# Altium schematic sheet Part19_UART_CP2104.SchDoc
size A4
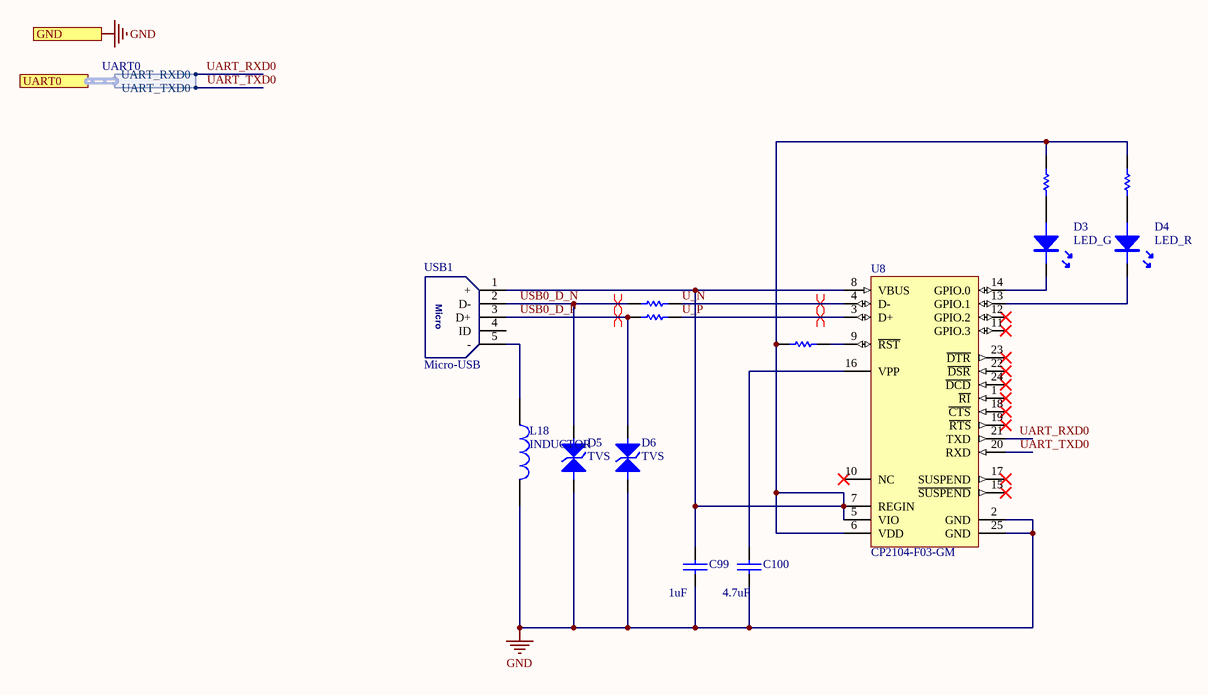
[diagram p0: Part19_UART_CP2104.SchDoc]

## Parts
C99  1uF  [0603C]
C100  4.7uF  [0603C]
D3  LED_G  [LED-0603B]
D4  LED_R  [LED-0603B]
D5  TVS  [SOD-123]
D6  TVS  [SOD-123]
L18  INDUCTOR  [0603L]
R77  470R  [0402R]  (value not drawn)
R78  470R  [0402R]  (value not drawn)
R79  22R  [0402R]  (value not drawn)
R80  22R  [0402R]  (value not drawn)
R81  4.7k  [0402R]  (value not drawn)
U8  CP2104-F03-GM  [SLAB-QFN-24-2675x2675TP_M]
USB1  Micro-USB  [USB-micro_B]

## Ports
GND, UART0 (harness UART0)

## Harnesses
UART0: UART_RXD0, UART_TXD0

## Nets
GND: C99.1 C100.1 D5.K D6.K L18.2 U8.2(GND) U8.25(GND) ; port GND
U_N: R79.2 U8.4(D-)
U_P: R80.2 U8.3(D+)
UART_RXD0: U8.21(TXD) ; port UART0.UART_RXD0
UART_TXD0: U8.20(RXD) ; port UART0.UART_TXD0
USB0_D_N: D5.A R79.1 USB1.2(D-)
USB0_D_P: D6.A R80.1 USB1.3(D+)
NetC99_2: C99.2 R77.2 R78.2 R81.1 U8.5(VIO) U8.6(VDD) U8.7(REGIN) U8.8(VBUS) USB1.1(+)
NetC100_2: C100.2 U8.16(VPP)
NetD3_A: D3.A R77.1
NetD3_K: D3.K U8.14(GPIO.0)
NetD4_A: D4.A R78.1
NetD4_K: D4.K U8.13(GPIO.1)
NetL18_1: L18.1 USB1.5(-)
NetR81_2: R81.2 U8.9(~{RST})

Not connected (* = marked no-connect by the designer): U8 1(~{RI})* 10(NC)* 11(GPIO.3)* 12(GPIO.2)* 15(~{SUSPEND})* 17(SUSPEND)* 18(~{CTS})* 19(~{RTS})* 22(~{DSR})* 23(~{DTR})* 24(~{DCD})*; USB1 4(ID)

## Layout directives
differential pair: U_N, U_P, USB0_D_N, USB0_D_P

## Notes on the sheet
- (in symbol Micro-USB) Micro

## Library data of the parts
C99 C100 = CAP: 无极性电容
D3 D4 = LED
D5 D6 = TVS: 双向瞬态抑制二极管
R77-R81 = RES
U8 = CMP-0511-00004-1: Single-Chip USB to UART Bridge, 4 Dig I/O Pins, Internal Oscillator, 1024 Bytes EEPROM, -40 to 85 degC, 24-pin QFN; Manufacturer: Silicon Labs; Sub-Family: USB Bridges; Internal Oscillator: TRUE; Mounting Technology: Surface Mount; ComponentLink3URL: http://www.silabs.com/Support%20Documents/TechnicalDocs/C8051F93x-92x.pdf; DatasheetVersion: Rev. 1.0; ComponentLink1URL: http://www.silabs.com/; Code_IPC: J-STD-020; ComponentLink2URL: http://www.silabs.com/Support%20Documents/TechnicalDocs/cp2104.pdf; Code_JEDEC: MO-220; PackageReference: QFN-24; ComponentLink3Description: Package Specification; PartNumber: CP2104-F03-GM; ComponentLink1Description: Manufacturer URL; ComponentLink2Description: Datasheet; EEPROM: 1024 Bytes; PackageDescription: 24-Pin Quad-Flat No-Leads Package, Body 4 x 4 mm, Pitch 0.5 mm